# Altium schematic sheet Low Distortion Oscillator.Amp3.SchDoc
size A4
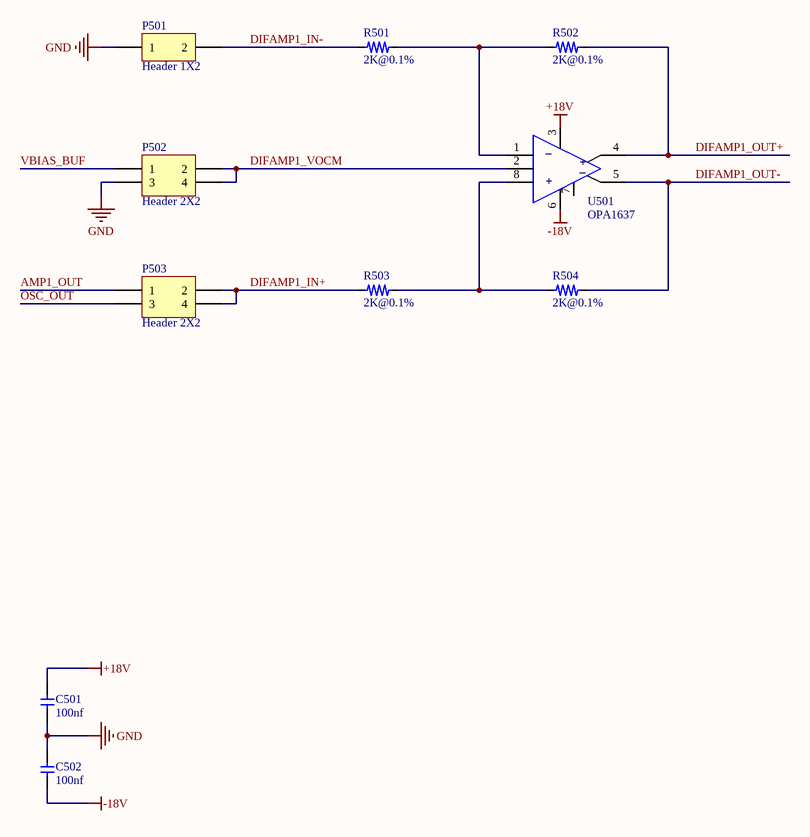
[diagram p0: Low Distortion Oscillator.Amp3.SchDoc]

## Parts
C501  value 100nf  [C0805]  (hidden comment: Cap)
C502  value 100nf  [C0805]  (hidden comment: Cap)
P501  Header 1X2  [HDR2X1]
P502  Header 2X2  [HDR2X2]
P503  Header 2X2  [HDR2X2]
R501  value 2K@0.1%  [R0805]  (hidden comment: Res)
R502  value 2K@0.1%  [R0805]  (hidden comment: Res)
R503  value 2K@0.1%  [R0805]  (hidden comment: Res)
R504  value 2K@0.1%  [R0805]  (hidden comment: Res)
U501  OPA1637  [OPA1637-VSSOP8]

## Nets
+18V: C501.2 U501.3(+Vs)
-18V: C502.1 U501.6(-Vs)
GND: C501.1 C502.2 P501.1 P502.3
AMP1_OUT: P503.1
DIFAMP1_IN+: P503.2 P503.4 R503.2
DIFAMP1_IN-: P501.2 R501.2
DIFAMP1_OUT+: R502.1 U501.4(OUT+)
DIFAMP1_OUT-: R504.1 U501.5(OUT-)
DIFAMP1_VOCM: P502.2 P502.4 U501.2(VOCM)
OSC_OUT: P503.3
VBIAS_BUF: P502.1
NetR501_1: R501.1 R502.2 U501.1(-IN)
NetR503_1: R503.1 R504.2 U501.8(+IN)

Not connected (* = marked no-connect by the designer): U501 7(~{PD})

## Notes on the sheet
- (in symbol OPA1637) –; +

## Library data of the parts
P501 = Header 1X2: Header, 1-Pin, Dual row
P502 P503 = Header 2X2: Header, 2-Pin, Dual row
R501-R504 = Res: 电阻
U501 = OPA1637: OPA1637 High-Fidelity, Low-Noise, Fully-Differential, Burr-Brown™ Audio Operational Amplifier